# EAGLE schematic untitled (EAGLE 9.2.2)
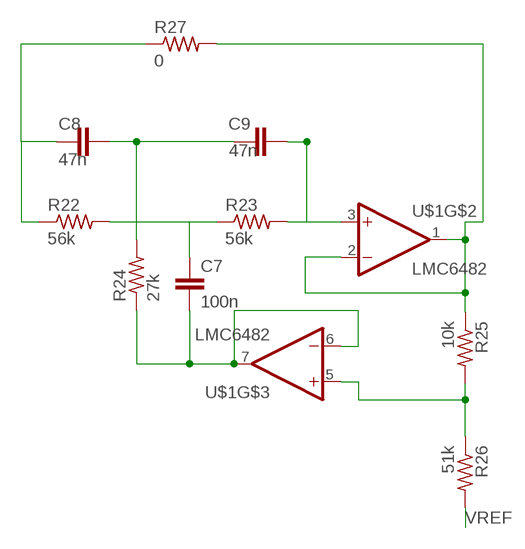
[diagram p0: schematic, sheet 1]

## Parts
C7  100n  C5/3  [C5B3]
C8  47n  C5/3  [C5B3]
C9  47n  C5/3  [C5B3]
R22  56k  R-US_0207/7  [0207/7]
R23  56k  R-US_0207/7  [0207/7]
R24  27k  R-US_0207/7  [0207/7]
R25  10k  R-US_0207/7  [0207/7]
R26  51k  R-US_0207/7  [0207/7]
R27  0  R-US_0207/7  [0207/7]
U$1  LMC6482  [SO8]

## Nets
N$21: C7.2 R24.1 U$1.6(-IN) U$1.7(OUT)
N$23: C7.1 R22.2 R23.1
N$24: C8.1 C9.1 R24.2
N$25: C9.2 R23.2 U$1.3(+IN)
N$26: R25.1 R27.2 U$1.1(OUT) U$1.2(-IN)
N$27: R25.2 R26.1 U$1.5(+IN)
N$30: C8.2 R22.1 R27.1
VREF: R26.2

## Power pins joined to a net without a drawn wire
V+: U$1.8(V+)
V-: U$1.4(V-)

## Library data of the parts
C7-C9 = capacitor-wima:C: CAPACITOR naming: grid - package width
R22-R27 = rcl:R-US_: RESISTOR, American symbol; SPICEPREFIX: R
U$1 = LMC6484:LMC6482